# EAGLE design Keybon REV 1.1 (EAGLE 7.7.0)
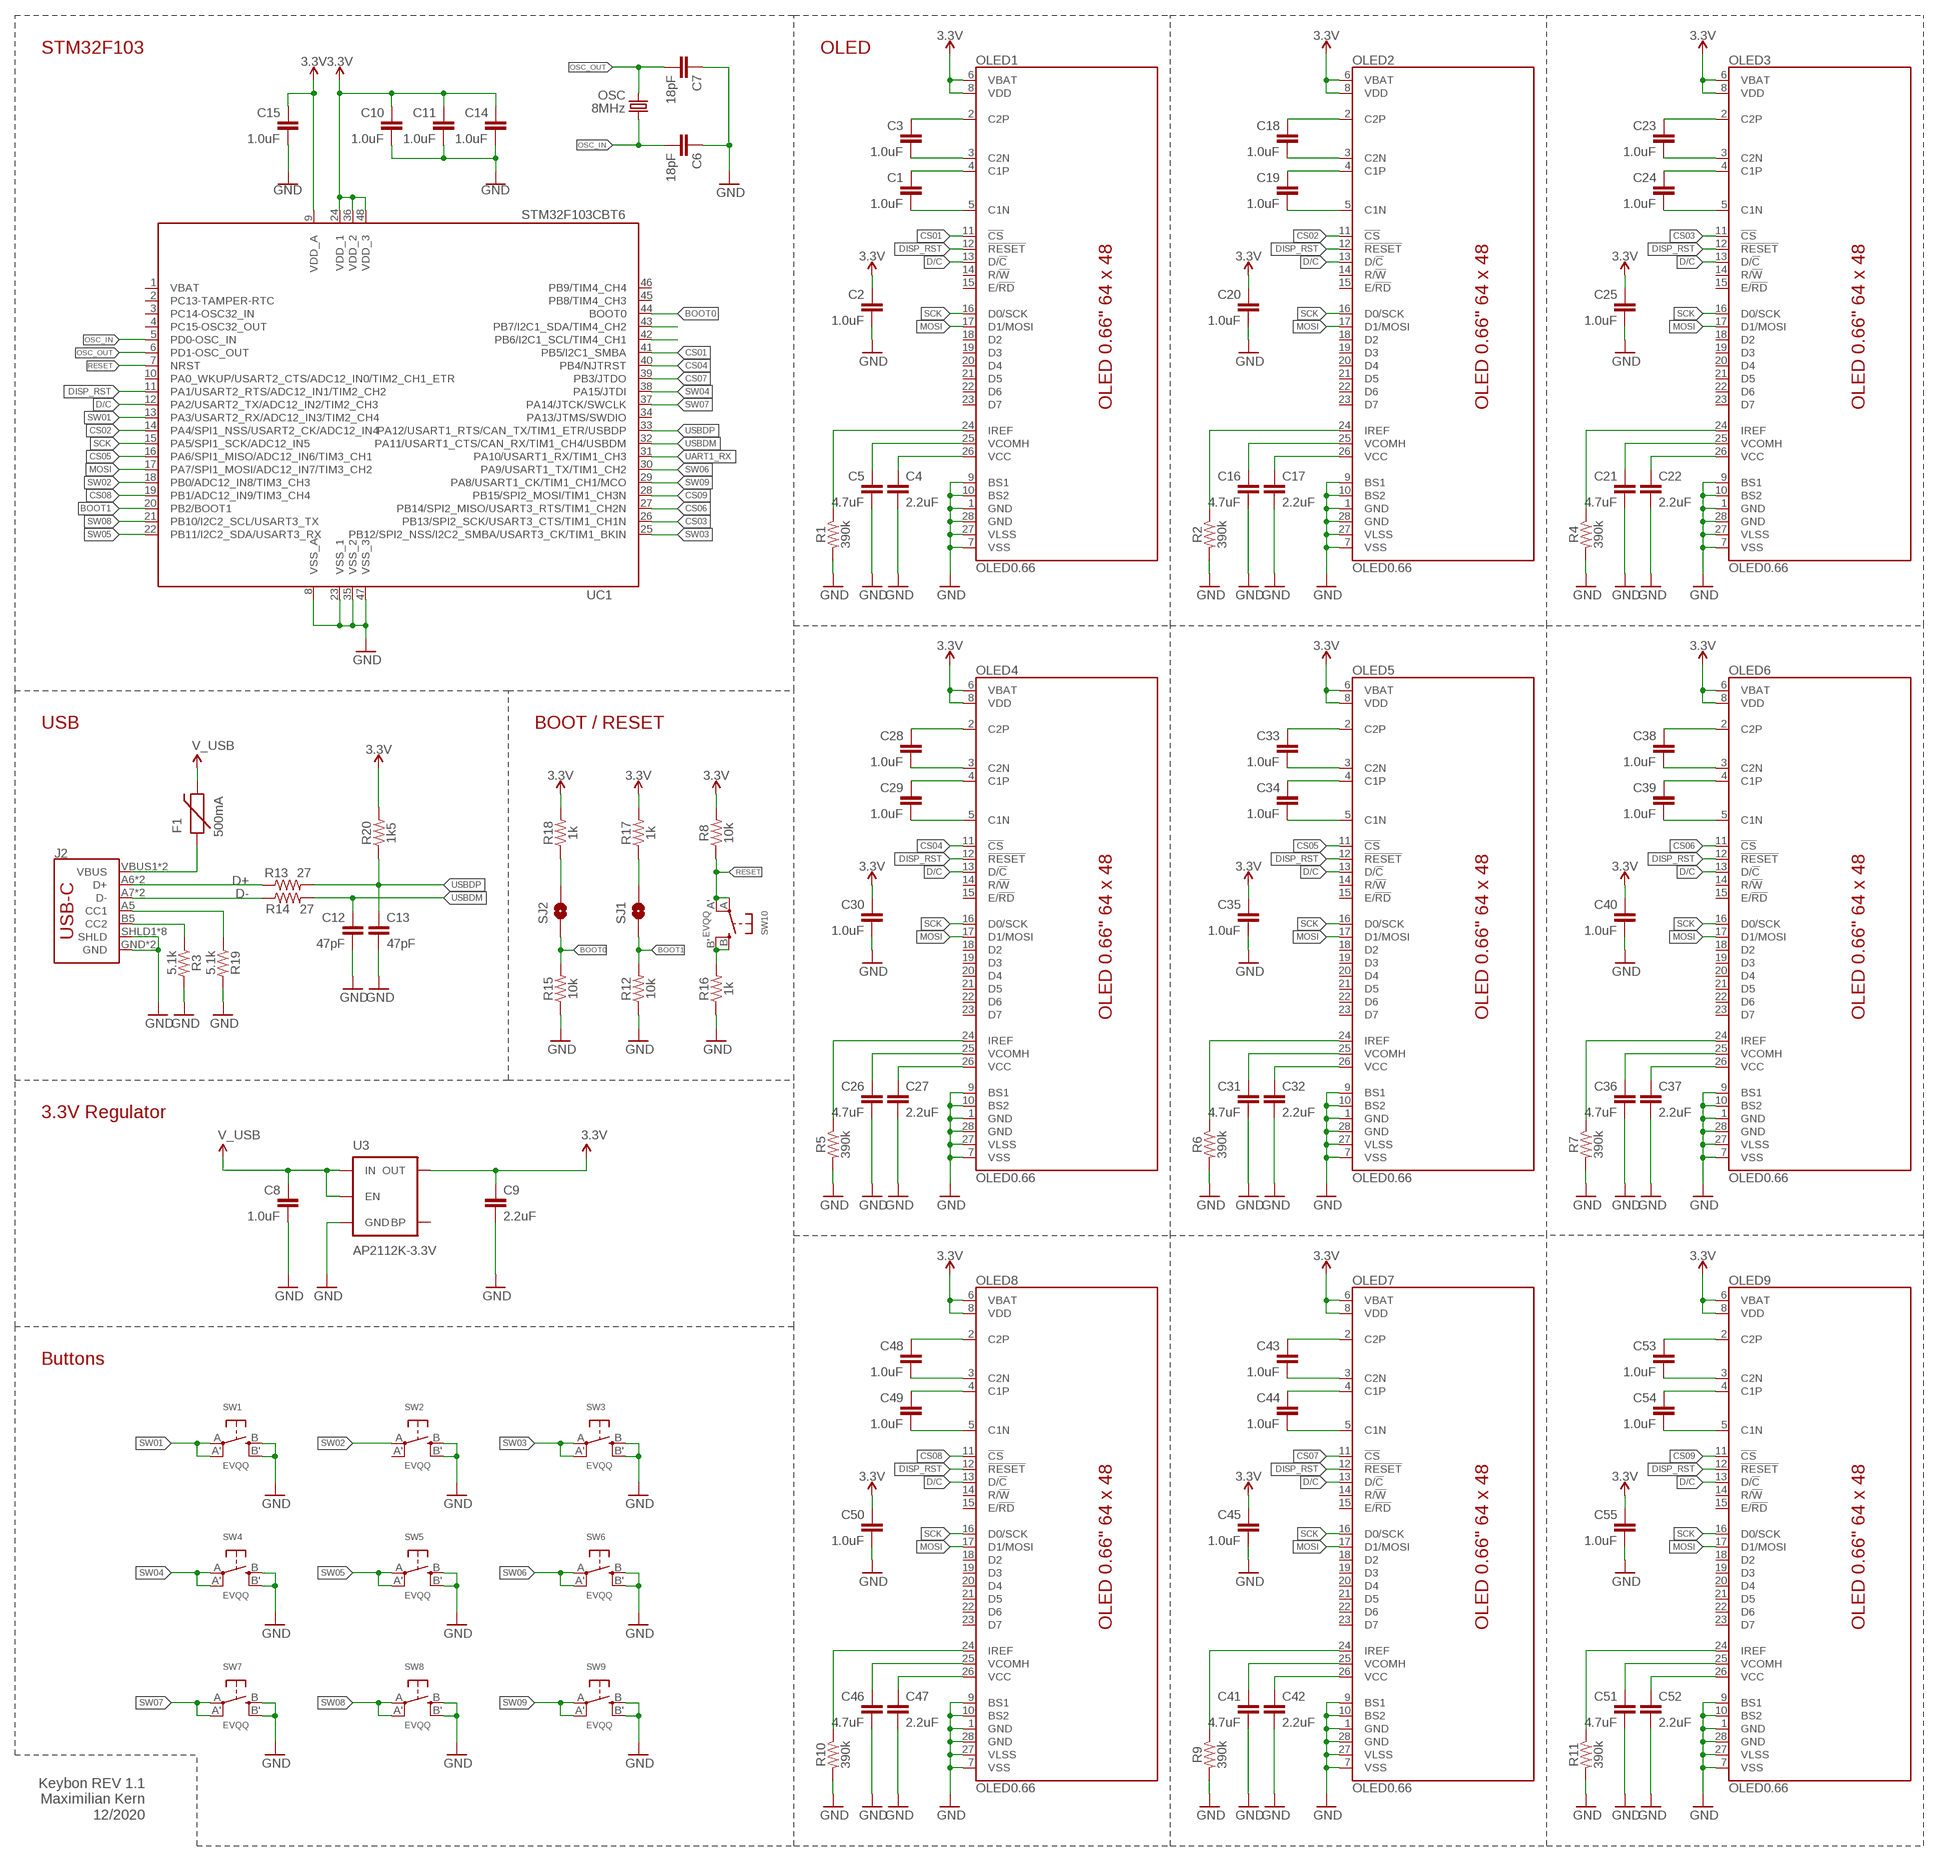
[diagram p0: schematic, sheet 1]

## Parts
C1  1.0uF  1.0UF-0805-25V-(+80/-20%)  [0805]
C2  1.0uF  1.0UF-0805-25V-(+80/-20%)  [0805]
C3  1.0uF  1.0UF-0805-25V-(+80/-20%)  [0805]
C4  2.2uF  1.0UF-0805-25V-(+80/-20%)  [0805]
C5  4.7uF  4.7UF0603  [0603]
C6  18pF  47PF-0603-50V-5%  [0603]
C7  18pF  47PF-0603-50V-5%  [0603]
C8  1.0uF  1.0UF-0805-25V-(+80/-20%)  [0805]
C9  2.2uF  1.0UF-0805-25V-(+80/-20%)  [0805]
C10  1.0uF  1.0UF-0805-25V-(+80/-20%)  [0805]
C11  1.0uF  1.0UF-0805-25V-(+80/-20%)  [0805]
C12  47pF  47PF-0603-50V-5%  [0603]
C13  47pF  47PF-0603-50V-5%  [0603]
C14  1.0uF  1.0UF-0805-25V-(+80/-20%)  [0805]
C15  1.0uF  1.0UF-0805-25V-(+80/-20%)  [0805]
C16  4.7uF  4.7UF0603  [0603]
C17  2.2uF  1.0UF-0805-25V-(+80/-20%)  [0805]
C18  1.0uF  1.0UF-0805-25V-(+80/-20%)  [0805]
C19  1.0uF  1.0UF-0805-25V-(+80/-20%)  [0805]
C20  1.0uF  1.0UF-0805-25V-(+80/-20%)  [0805]
C21  4.7uF  4.7UF0603  [0603]
C22  2.2uF  1.0UF-0805-25V-(+80/-20%)  [0805]
C23  1.0uF  1.0UF-0805-25V-(+80/-20%)  [0805]
C24  1.0uF  1.0UF-0805-25V-(+80/-20%)  [0805]
C25  1.0uF  1.0UF-0805-25V-(+80/-20%)  [0805]
C26  4.7uF  4.7UF0603  [0603]
C27  2.2uF  1.0UF-0805-25V-(+80/-20%)  [0805]
C28  1.0uF  1.0UF-0805-25V-(+80/-20%)  [0805]
C29  1.0uF  1.0UF-0805-25V-(+80/-20%)  [0805]
C30  1.0uF  1.0UF-0805-25V-(+80/-20%)  [0805]
C31  4.7uF  4.7UF0603  [0603]
C32  2.2uF  1.0UF-0805-25V-(+80/-20%)  [0805]
C33  1.0uF  1.0UF-0805-25V-(+80/-20%)  [0805]
C34  1.0uF  1.0UF-0805-25V-(+80/-20%)  [0805]
C35  1.0uF  1.0UF-0805-25V-(+80/-20%)  [0805]
C36  4.7uF  4.7UF0603  [0603]
C37  2.2uF  1.0UF-0805-25V-(+80/-20%)  [0805]
C38  1.0uF  1.0UF-0805-25V-(+80/-20%)  [0805]
C39  1.0uF  1.0UF-0805-25V-(+80/-20%)  [0805]
C40  1.0uF  1.0UF-0805-25V-(+80/-20%)  [0805]
C41  4.7uF  4.7UF0603  [0603]
C42  2.2uF  1.0UF-0805-25V-(+80/-20%)  [0805]
C43  1.0uF  1.0UF-0805-25V-(+80/-20%)  [0805]
C44  1.0uF  1.0UF-0805-25V-(+80/-20%)  [0805]
C45  1.0uF  1.0UF-0805-25V-(+80/-20%)  [0805]
C46  4.7uF  4.7UF0603  [0603]
C47  2.2uF  1.0UF-0805-25V-(+80/-20%)  [0805]
C48  1.0uF  1.0UF-0805-25V-(+80/-20%)  [0805]
C49  1.0uF  1.0UF-0805-25V-(+80/-20%)  [0805]
C50  1.0uF  1.0UF-0805-25V-(+80/-20%)  [0805]
C51  4.7uF  4.7UF0603  [0603]
C52  2.2uF  1.0UF-0805-25V-(+80/-20%)  [0805]
C53  1.0uF  1.0UF-0805-25V-(+80/-20%)  [0805]
C54  1.0uF  1.0UF-0805-25V-(+80/-20%)  [0805]
C55  1.0uF  1.0UF-0805-25V-(+80/-20%)  [0805]
F1  500mA  PTCSMD  [PTC-1206]
J2  USB_C16PIN  [USB-C-16P]
OLED1  OLED0.66  [OLED-0.66-64X48]
OLED2  OLED0.66  [OLED-0.66-64X48]
OLED3  OLED0.66  [OLED-0.66-64X48]
OLED4  OLED0.66  [OLED-0.66-64X48]
OLED5  OLED0.66  [OLED-0.66-64X48]
OLED6  OLED0.66  [OLED-0.66-64X48]
OLED7  OLED0.66  [OLED-0.66-64X48]
OLED8  OLED0.66  [OLED-0.66-64X48]
OLED9  OLED0.66  [OLED-0.66-64X48]
OSC  8MHz  CRYSTAL5X3  [CRYSTAL-SMD-5X3]
R1  390k  10KOHM-0603-1/10W-1%  [0603]
R2  390k  10KOHM-0603-1/10W-1%  [0603]
R3  5.1k  10KOHM-0603-1/10W-1%  [0603]
R4  390k  10KOHM-0603-1/10W-1%  [0603]
R5  390k  10KOHM-0603-1/10W-1%  [0603]
R6  390k  10KOHM-0603-1/10W-1%  [0603]
R7  390k  10KOHM-0603-1/10W-1%  [0603]
R8  10k  10KOHM-0603-1/10W-1%  [0603]
R9  390k  10KOHM-0603-1/10W-1%  [0603]
R10  390k  10KOHM-0603-1/10W-1%  [0603]
R11  390k  10KOHM-0603-1/10W-1%  [0603]
R12  10k  10KOHM-0603-1/10W-1%  [0603]
R13  27  27OHM1/10W1%(0603)0603-RES  [0603]
R14  27  27OHM1/10W1%(0603)0603-RES  [0603]
R15  10k  10KOHM-0603-1/10W-1%  [0603]
R16  1k  10KOHM-0603-1/10W-1%  [0603]
R17  1k  10KOHM-0603-1/10W-1%  [0603]
R18  1k  10KOHM-0603-1/10W-1%  [0603]
R19  5.1k  10KOHM-0603-1/10W-1%  [0603]
R20  1k5  10KOHM-0603-1/10W-1%  [0603]
SJ1  JUMPER-PAD-2-NOYES_SILK  [PAD-JUMPER-2-NO_YES_SILK]
SJ2  JUMPER-PAD-2-NOYES_SILK  [PAD-JUMPER-2-NO_YES_SILK]
SW1  EVQQ  SWITCH_TACT_SMT_EVQQ2_SMALL  [EVQ-Q2_SMALLER]
SW2  EVQQ  SWITCH_TACT_SMT_EVQQ2_SMALL  [EVQ-Q2_SMALLER]
SW3  EVQQ  SWITCH_TACT_SMT_EVQQ2_SMALL  [EVQ-Q2_SMALLER]
SW4  EVQQ  SWITCH_TACT_SMT_EVQQ2_SMALL  [EVQ-Q2_SMALLER]
SW5  EVQQ  SWITCH_TACT_SMT_EVQQ2_SMALL  [EVQ-Q2_SMALLER]
SW6  EVQQ  SWITCH_TACT_SMT_EVQQ2_SMALL  [EVQ-Q2_SMALLER]
SW7  EVQQ  SWITCH_TACT_SMT_EVQQ2_SMALL  [EVQ-Q2_SMALLER]
SW8  EVQQ  SWITCH_TACT_SMT_EVQQ2_SMALL  [EVQ-Q2_SMALLER]
SW9  EVQQ  SWITCH_TACT_SMT_EVQQ2_SMALL  [EVQ-Q2_SMALLER]
SW10  EVQQ  SWITCH_TACT_SMT_EVQQ2_SMALL  [EVQ-Q2_SMALLER]
U3  AP2112K-3.3V  V_REG_LDOSMD  [SOT23-5]
UC1  STM32F103CBT6  STM32F103CB  [LQFP48]

## Nets
3.3V: C2.1 C9.1 C10.1 C11.1 C14.1 C15.1 C20.1 C25.1 C30.1 C35.1 C40.1 C45.1 C50.1 C55.1 OLED1.6(VBAT) OLED1.8(VDD) OLED2.6(VBAT) OLED2.8(VDD) OLED3.6(VBAT) OLED3.8(VDD) OLED4.6(VBAT) OLED4.8(VDD) OLED5.6(VBAT) OLED5.8(VDD) OLED6.6(VBAT) OLED6.8(VDD) OLED7.6(VBAT) OLED7.8(VDD) OLED8.6(VBAT) OLED8.8(VDD) OLED9.6(VBAT) OLED9.8(VDD) R8.2 R17.2 R18.2 R20.2 U3.5(OUT) UC1.9(VDD_A) UC1.24(VDD_1) UC1.36(VDD_2) UC1.48(VDD_3)
BOOT0: R15.2 SJ2.1 UC1.44(BOOT0)
BOOT1: R12.2 SJ1.1 UC1.20(PB2/BOOT1)
C1N: C1.2 OLED1.5(C1N)
C1N1: C19.2 OLED2.5(C1N)
C1N2: C24.2 OLED3.5(C1N)
C1N3: C29.2 OLED4.5(C1N)
C1N4: C34.2 OLED5.5(C1N)
C1N5: C39.2 OLED6.5(C1N)
C1N6: C44.2 OLED7.5(C1N)
C1N7: C49.2 OLED8.5(C1N)
C1N8: C54.2 OLED9.5(C1N)
C1P: C1.1 OLED1.4(C1P)
C1P1: C19.1 OLED2.4(C1P)
C1P2: C24.1 OLED3.4(C1P)
C1P3: C29.1 OLED4.4(C1P)
C1P4: C34.1 OLED5.4(C1P)
C1P5: C39.1 OLED6.4(C1P)
C1P6: C44.1 OLED7.4(C1P)
C1P7: C49.1 OLED8.4(C1P)
C1P8: C54.1 OLED9.4(C1P)
C2N: C3.2 OLED1.3(C2N)
C2N1: C18.2 OLED2.3(C2N)
C2N2: C23.2 OLED3.3(C2N)
C2N3: C28.2 OLED4.3(C2N)
C2N4: C33.2 OLED5.3(C2N)
C2N5: C38.2 OLED6.3(C2N)
C2N6: C43.2 OLED7.3(C2N)
C2N7: C48.2 OLED8.3(C2N)
C2N8: C53.2 OLED9.3(C2N)
C2P: C3.1 OLED1.2(C2P)
C2P1: C18.1 OLED2.2(C2P)
C2P2: C23.1 OLED3.2(C2P)
C2P3: C28.1 OLED4.2(C2P)
C2P4: C33.1 OLED5.2(C2P)
C2P5: C38.1 OLED6.2(C2P)
C2P6: C43.1 OLED7.2(C2P)
C2P7: C48.1 OLED8.2(C2P)
C2P8: C53.1 OLED9.2(C2P)
CS01: OLED1.11(!CS!) UC1.41(PB5/I2C1_SMBA)
CS02: OLED2.11(!CS!) UC1.14(PA4/SPI1_NSS/USART2_CK/ADC12_IN4)
CS03: OLED3.11(!CS!) UC1.26(PB13/SPI2_SCK/USART3_CTS/TIM1_CH1N)
CS04: OLED4.11(!CS!) UC1.40(PB4/NJTRST)
CS05: OLED5.11(!CS!) UC1.16(PA6/SPI1_MISO/ADC12_IN6/TIM3_CH1)
CS06: OLED6.11(!CS!) UC1.27(PB14/SPI2_MISO/USART3_RTS/TIM1_CH2N)
CS07: OLED7.11(!CS!) UC1.39(PB3/JTDO)
CS08: OLED8.11(!CS!) UC1.19(PB1/ADC12_IN9/TIM3_CH4)
CS09: OLED9.11(!CS!) UC1.28(PB15/SPI2_MOSI/TIM1_CH3N)
D+: J2.A6(D+) J2.B6(D+) R13.1
D-: J2.A7(D-) J2.B7(D-) R14.1
D/C: OLED1.13(D/!C!) OLED2.13(D/!C!) OLED3.13(D/!C!) OLED4.13(D/!C!) OLED5.13(D/!C!) OLED6.13(D/!C!) OLED7.13(D/!C!) OLED8.13(D/!C!) OLED9.13(D/!C!) UC1.12(PA2/USART2_TX/ADC12_IN2/TIM2_CH3)
DISP_RST: OLED1.12(!RESET!) OLED2.12(!RESET!) OLED3.12(!RESET!) OLED4.12(!RESET!) OLED5.12(!RESET!) OLED6.12(!RESET!) OLED7.12(!RESET!) OLED8.12(!RESET!) OLED9.12(!RESET!) UC1.11(PA1/USART2_RTS/ADC12_IN1/TIM2_CH2)
GND: C2.2 C4.2 C5.2 C6.1 C7.1 C8.2 C9.2 C10.2 C11.2 C12.2 C13.2 C14.2 C15.2 C16.2 C17.2 C20.2 C21.2 C22.2 C25.2 C26.2 C27.2 C30.2 C31.2 C32.2 C35.2 C36.2 C37.2 C40.2 C41.2 C42.2 C45.2 C46.2 C47.2 C50.2 C51.2 C52.2 C55.2 J2.GND J2.GND2(GND) J2.SHLD1(SHLD) J2.SHLD2(SHLD) J2.SHLD3(SHLD) J2.SHLD4(SHLD) J2.SHLD5(SHLD) J2.SHLD6(SHLD) J2.SHLD7(SHLD) J2.SHLD8(SHLD) OLED1.1(GND) OLED1.7(VSS) OLED1.9(BS1) OLED1.10(BS2) OLED1.27(VLSS) OLED1.28(GND) OLED2.1(GND) OLED2.7(VSS) OLED2.9(BS1) OLED2.10(BS2) OLED2.27(VLSS) OLED2.28(GND) OLED3.1(GND) OLED3.7(VSS) OLED3.9(BS1) OLED3.10(BS2) OLED3.27(VLSS) OLED3.28(GND) OLED4.1(GND) OLED4.7(VSS) OLED4.9(BS1) OLED4.10(BS2) OLED4.27(VLSS) OLED4.28(GND) OLED5.1(GND) OLED5.7(VSS) OLED5.9(BS1) OLED5.10(BS2) OLED5.27(VLSS) OLED5.28(GND) OLED6.1(GND) OLED6.7(VSS) OLED6.9(BS1) OLED6.10(BS2) OLED6.27(VLSS) OLED6.28(GND) OLED7.1(GND) OLED7.7(VSS) OLED7.9(BS1) OLED7.10(BS2) OLED7.27(VLSS) OLED7.28(GND) OLED8.1(GND) OLED8.7(VSS) OLED8.9(BS1) OLED8.10(BS2) OLED8.27(VLSS) OLED8.28(GND) OLED9.1(GND) OLED9.7(VSS) OLED9.9(BS1) OLED9.10(BS2) OLED9.27(VLSS) OLED9.28(GND) R1.2 R2.2 R3.2 R4.2 R5.2 R6.2 R7.2 R9.2 R10.2 R11.2 R12.1 R15.1 R16.1 R19.2 SW1.B'(S1) SW1.B(S) SW2.B'(S1) SW2.B(S) SW3.B'(S1) SW3.B(S) SW4.B'(S1) SW4.B(S) SW5.B'(S1) SW5.B(S) SW6.B'(S1) SW6.B(S) SW7.B'(S1) SW7.B(S) SW8.B'(S1) SW8.B(S) SW9.B'(S1) SW9.B(S) U3.2(GND) UC1.8(VSS_A) UC1.23(VSS_1) UC1.35(VSS_2) UC1.47(VSS_3)
IREF: OLED1.24(IREF) R1.1
IREF1: OLED2.24(IREF) R2.1
IREF2: OLED3.24(IREF) R4.1
IREF3: OLED4.24(IREF) R5.1
IREF4: OLED5.24(IREF) R6.1
IREF5: OLED6.24(IREF) R7.1
IREF6: OLED7.24(IREF) R9.1
IREF7: OLED8.24(IREF) R10.1
IREF8: OLED9.24(IREF) R11.1
MOSI: OLED1.17(D1/MOSI) OLED2.17(D1/MOSI) OLED3.17(D1/MOSI) OLED4.17(D1/MOSI) OLED5.17(D1/MOSI) OLED6.17(D1/MOSI) OLED7.17(D1/MOSI) OLED8.17(D1/MOSI) OLED9.17(D1/MOSI) UC1.17(PA7/SPI1_MOSI/ADC12_IN7/TIM3_CH2)
N$1: R16.2 SW10.B'(S1) SW10.B(S)
N$2: R18.1 SJ2.2
N$3: R17.1 SJ1.2
N$4: C4.1 OLED1.26(VCC)
N$5: C17.1 OLED2.26(VCC)
N$6: C22.1 OLED3.26(VCC)
N$7: C37.1 OLED6.26(VCC)
N$8: C32.1 OLED5.26(VCC)
N$9: J2.A5(CC1) R19.1
N$10: C27.1 OLED4.26(VCC)
N$11: J2.B5(CC2) R3.1
N$12: C47.1 OLED8.26(VCC)
N$13: C42.1 OLED7.26(VCC)
N$14: C52.1 OLED9.26(VCC)
N$19: UC1.42(PB6/I2C1_SCL/TIM4_CH1)
N$20: UC1.43(PB7/I2C1_SDA/TIM4_CH2)
OSC_IN: C6.2 OSC.1 UC1.5(PD0-OSC_IN)
OSC_OUT: C7.2 OSC.3 UC1.6(PD1-OSC_OUT)
RESET: R8.1 SW10.A'(P1) SW10.A(P) UC1.7(NRST)
SCK: OLED1.16(D0/SCK) OLED2.16(D0/SCK) OLED3.16(D0/SCK) OLED4.16(D0/SCK) OLED5.16(D0/SCK) OLED6.16(D0/SCK) OLED7.16(D0/SCK) OLED8.16(D0/SCK) OLED9.16(D0/SCK) UC1.15(PA5/SPI1_SCK/ADC12_IN5)
SW01: SW1.A'(P1) SW1.A(P) UC1.13(PA3/USART2_RX/ADC12_IN3/TIM2_CH4)
SW02: SW2.A(P) UC1.18(PB0/ADC12_IN8/TIM3_CH3)
SW03: SW3.A'(P1) SW3.A(P) UC1.25(PB12/SPI2_NSS/I2C2_SMBA/USART3_CK/TIM1_BKIN)
SW04: SW4.A'(P1) SW4.A(P) UC1.38(PA15/JTDI)
SW05: SW5.A'(P1) SW5.A(P) UC1.22(PB11/I2C2_SDA/USART3_RX)
SW06: SW6.A'(P1) SW6.A(P) UC1.30(PA9/USART1_TX/TIM1_CH2)
SW07: SW7.A'(P1) SW7.A(P) UC1.37(PA14/JTCK/SWCLK)
SW08: SW8.A'(P1) SW8.A(P) UC1.21(PB10/I2C2_SCL/USART3_TX)
SW09: SW9.A'(P1) SW9.A(P) UC1.29(PA8/USART1_CK/TIM1_CH1/MCO)
UART1_RX: UC1.31(PA10/USART1_RX/TIM1_CH3)
USBDM: C12.1 R14.2 UC1.32(PA11/USART1_CTS/CAN_RX/TIM1_CH4/USBDM)
USBDP: C13.1 R13.2 R20.1 UC1.33(PA12/USART1_RTS/CAN_TX/TIM1_ETR/USBDP)
V_USB: C8.1 F1.2 U3.1(IN) U3.3(EN)
VCOMH: C5.1 OLED1.25(VCOMH)
VCOMH1: C16.1 OLED2.25(VCOMH)
VCOMH2: C21.1 OLED3.25(VCOMH)
VCOMH3: C26.1 OLED4.25(VCOMH)
VCOMH4: C31.1 OLED5.25(VCOMH)
VCOMH5: C36.1 OLED6.25(VCOMH)
VCOMH6: C41.1 OLED7.25(VCOMH)
VCOMH7: C46.1 OLED8.25(VCOMH)
VCOMH8: C51.1 OLED9.25(VCOMH)
VUSB-RAW: F1.1 J2.VBUS1(VBUS) J2.VBUS2(VBUS)
Unconnected: OLED1.14(R/!W!) OLED1.15(E/!RD!) OLED1.18(D2) OLED1.19(D3) OLED1.20(D4) OLED1.21(D5) OLED1.22(D6) OLED1.23(D7) OLED2.14(R/!W!) OLED2.15(E/!RD!) OLED2.18(D2) OLED2.19(D3) OLED2.20(D4) OLED2.21(D5) OLED2.22(D6) OLED2.23(D7) OLED3.14(R/!W!) OLED3.15(E/!RD!) OLED3.18(D2) OLED3.19(D3) OLED3.20(D4) OLED3.21(D5) OLED3.22(D6) OLED3.23(D7) OLED4.14(R/!W!) OLED4.15(E/!RD!) OLED4.18(D2) OLED4.19(D3) OLED4.20(D4) OLED4.21(D5) OLED4.22(D6) OLED4.23(D7) OLED5.14(R/!W!) OLED5.15(E/!RD!) OLED5.18(D2) OLED5.19(D3) OLED5.20(D4) OLED5.21(D5) OLED5.22(D6) OLED5.23(D7) OLED6.14(R/!W!) OLED6.15(E/!RD!) OLED6.18(D2) OLED6.19(D3) OLED6.20(D4) OLED6.21(D5) OLED6.22(D6) OLED6.23(D7) OLED7.14(R/!W!) OLED7.15(E/!RD!) OLED7.18(D2) OLED7.19(D3) OLED7.20(D4) OLED7.21(D5) OLED7.22(D6) OLED7.23(D7) OLED8.14(R/!W!) OLED8.15(E/!RD!) OLED8.18(D2) OLED8.19(D3) OLED8.20(D4) OLED8.21(D5) OLED8.22(D6) OLED8.23(D7) OLED9.14(R/!W!) OLED9.15(E/!RD!) OLED9.18(D2) OLED9.19(D3) OLED9.20(D4) OLED9.21(D5) OLED9.22(D6) OLED9.23(D7) SW2.A'(P1) U3.4(BP) UC1.2(PC13-TAMPER-RTC) UC1.3(PC14-OSC32_IN) UC1.4(PC15-OSC32_OUT) UC1.10(PA0_WKUP/USART2_CTS/ADC12_IN0/TIM2_CH1_ETR) UC1.34(PA13/JTMS/SWDIO) UC1.45(PB8/TIM4_CH3) UC1.46(PB9/TIM4_CH4)

## Notes on the sheet
- STM32F103 | OLED
- USB | BOOT / RESET
- 3.3V Regulator
- Buttons
- Keybon REV 1.1
  Maximilian Kern
  12/2020

## Power pins joined to a net without a drawn wire
VBAT: UC1.1(VBAT)

## Library data of the parts
C1-C3 C8 C10 C11 C14 C15 C18-C20 C23-C25 C28-C30 C33-C35 C38-C40 C43-C45 C48-C50 C53-C55 = SparkFun-Capacitors:1.0UF: 1µF ceramic capacitors A capacitor is a passive two-terminal electrical component used to store electrical energy temporarily in an electric field.; PROD_ID: CAP-11625
C4 C9 C17 C22 C27 C32 C37 C42 C47 C52 = SparkFun-Capacitors:1.0UF: 1µF ceramic capacitors A capacitor is a passive two-terminal electrical component used to store electrical energy temporarily in an electric field.; PROD_ID: CAP-11625; VALUE: 1.0uF
C5 C16 C21 C26 C31 C36 C41 C46 C51 = SparkFun-Capacitors:4.7UF: 4.7µF ceramic capacitors A capacitor is a passive two-terminal electrical component used to store electrical energy temporarily in an electric field.; PROD_ID: CAP-08280
C6 C7 = SparkFun-Capacitors:47PF: 47pF ceramic capacitors A capacitor is a passive two-terminal electrical component used to store electrical energy temporarily in an electric field.; PROD_ID: CAP-08913; VALUE: 47pF
C12 C13 = SparkFun-Capacitors:47PF: 47pF ceramic capacitors A capacitor is a passive two-terminal electrical component used to store electrical energy temporarily in an electric field.; PROD_ID: CAP-08913
F1 = SparkFun-PowerIC:PTC: Resettable Fuse PTC Resettable Fuse. Spark Fun Electronics SKU : COM-08357; PROD_ID: RES-11150
J2 = SparkFun-Connectors:USB_C: USB Type C 16Pin Connector Super Speed pins not available on the 16-pin purely SMD connector so this part is best for USB 2.0 implementations. D1 and D2 are tied together enabling D+/- no matter which way the cable is plugged into the connector. The two channel configuration pins (CC1/2) are exposed. These are normally connected to ground via 5.1k resistors but can be reconfigured for high current/high power applications.; PROD_ID: CONN-14122
OLED1-OLED9 = microView-temp:OLED0.66
OSC = SparkFun2:CRYSTAL: Crystals Various standard crystals. Proven footprints. Spark Fun Electronics SKU : COM-00534
R1-R7 R9-R11 R16-R20 = SparkFun-Resistors:10KOHM: 10kΩ resistor A resistor is a passive two-terminal electrical component that implements electrical resistance as a circuit element. Resistors act to reduce current flow, and, at the same time, act to lower voltage levels within circuits. - Wikipedia; PROD_ID: RES-00824; VALUE: 10k
R8 R12 R15 = SparkFun-Resistors:10KOHM: 10kΩ resistor A resistor is a passive two-terminal electrical component that implements electrical resistance as a circuit element. Resistors act to reduce current flow, and, at the same time, act to lower voltage levels within circuits. - Wikipedia; PROD_ID: RES-00824
R13 R14 = SparkFun-Resistors:27OHM1/10W1%(0603): RES-09334; PROD_ID: RES-09334
SJ1 SJ2 = SparkFun-Passives:JUMPER-PAD-2-NO
SW1-SW10 = microbuilder:SWITCH_TACT_SMT: SMT Tact Switches 6x6mm - Digikey: P12940SCT-ND KMR2 (4.6x2.8mm) - Digikey: 401-1426-1-ND EVQ-PQHB55 - Light Touch, 160GF (4.5x4.5mm) - Digikey: P8090SCT-ND KMT0 - KMT021 NGJ LHS (etc.) IP68/Waterproof - Digikey: CKN10289CT-ND
U3 = SparkFun-PowerIC:V_REG_LDO: Voltage Regulator LDO Standard 150mA LDO voltage regulator in SOT-23 layout. Micrel part MIC5205. BP (by-pass) pin is used to lower output noise with 470pF cap.; PROD_ID: VREG-12457
UC1 = stm32:STM32F103CB

## Board
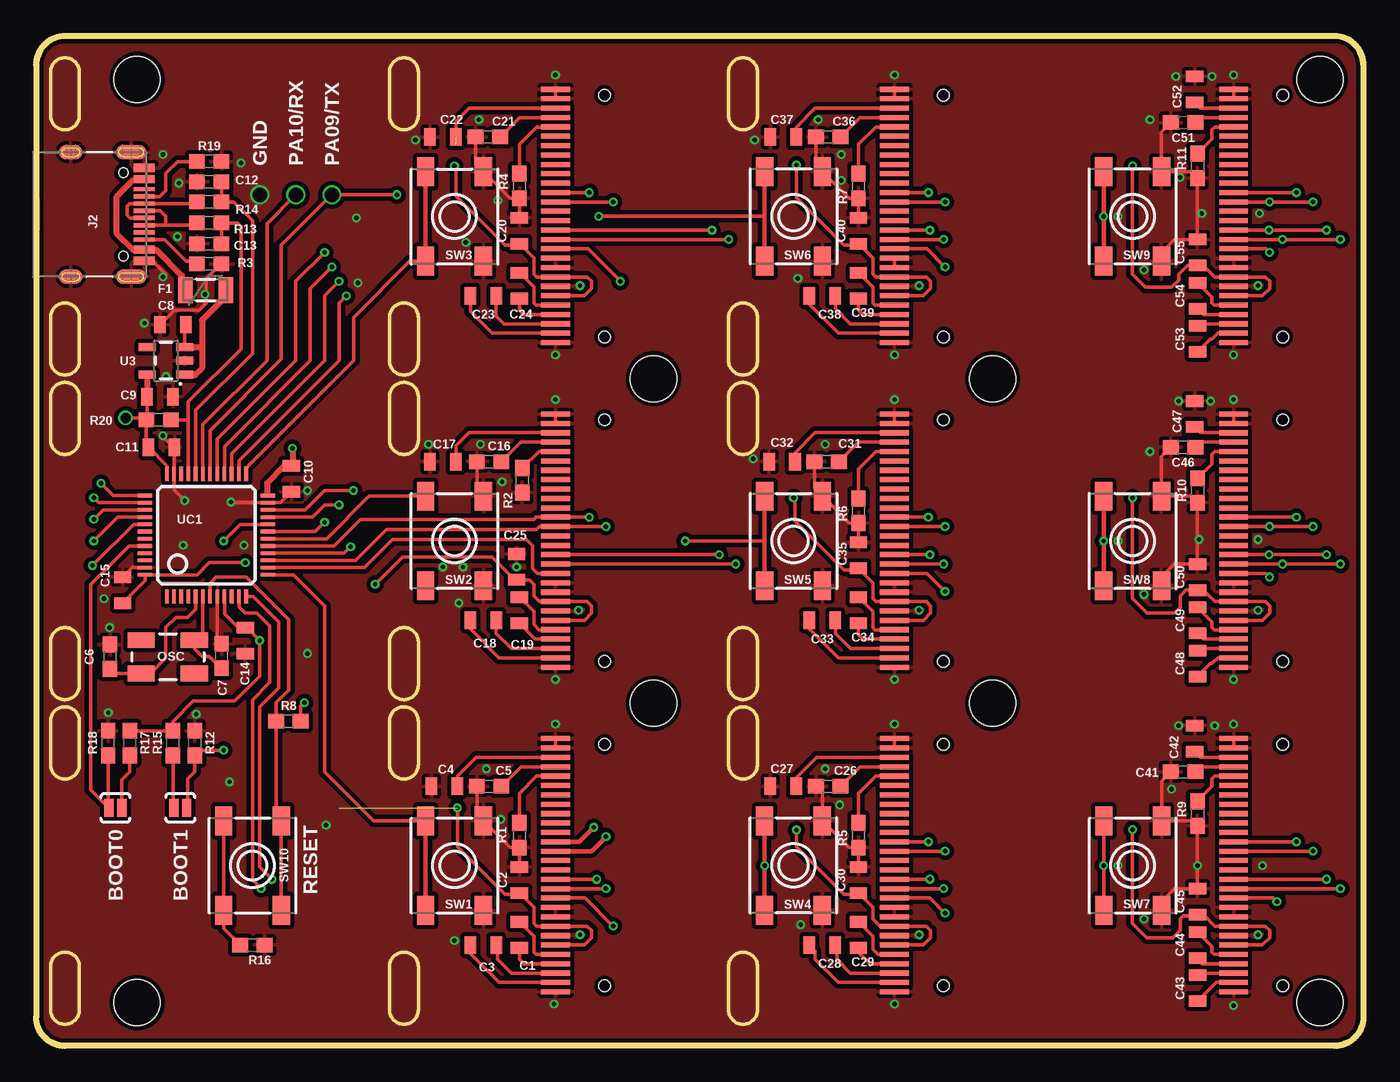
[diagram p1: board, top side]
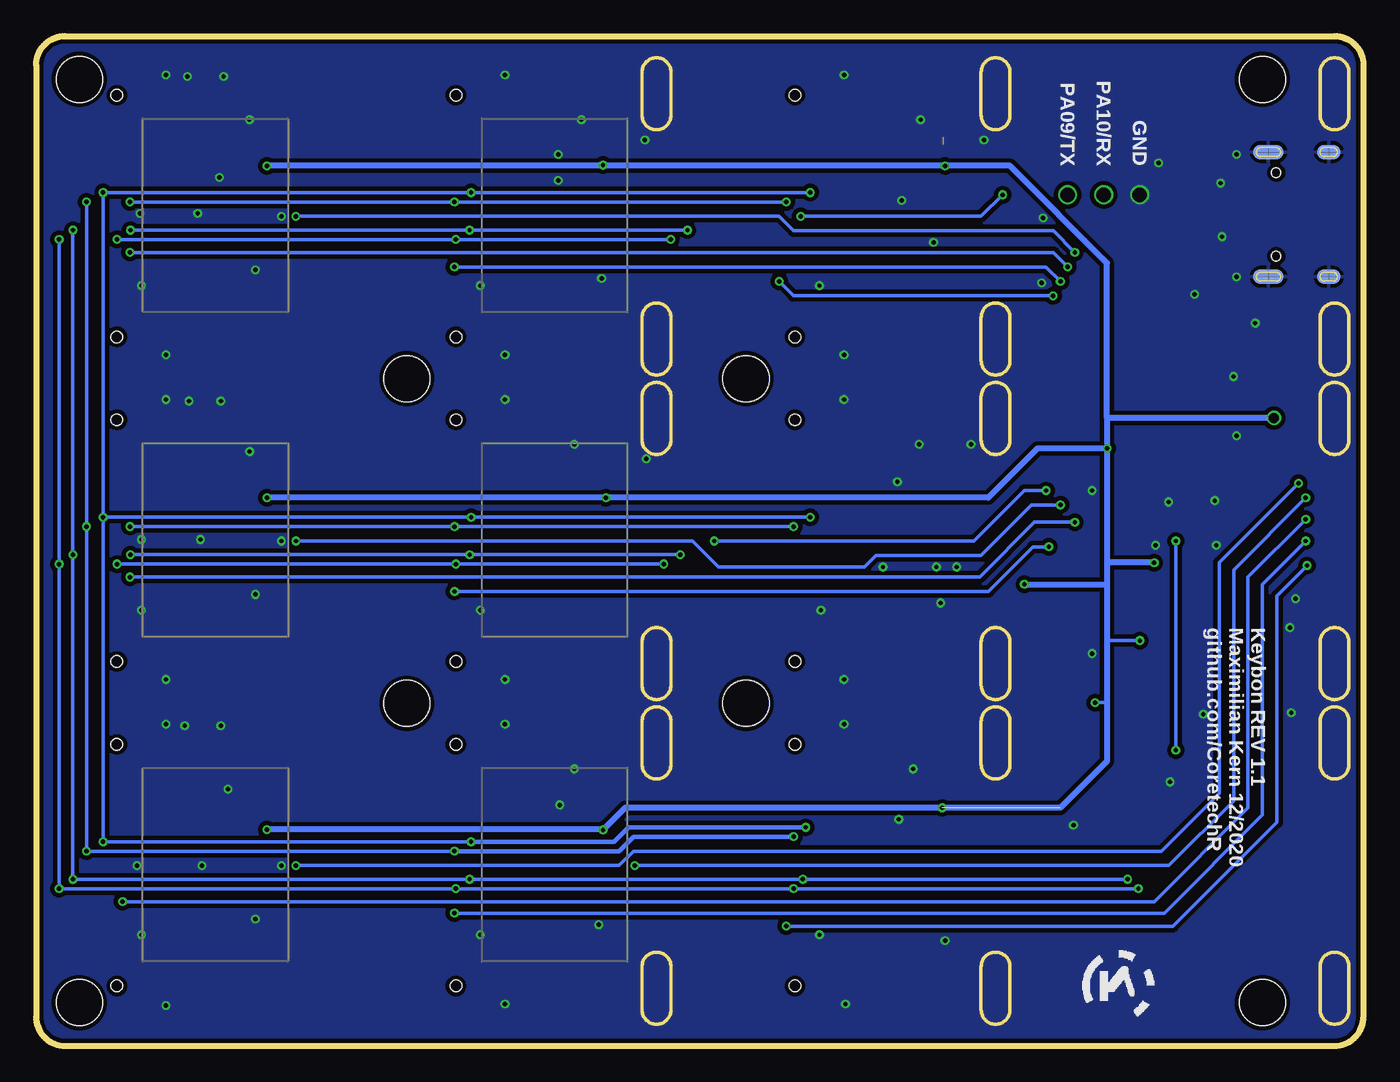
[diagram p2: board, bottom side, seen from below]

Size 92 x 70 mm. Coordinates in mm from the lower left corner, seen from the top.
Outline: 90,0 2,0 arc-90 0,2 0,68 arc-90 2,70 90,70 arc-90 92,68 92,2 arc-90 90,0
Copper layers (1*16): Top 0.035mm / dielectric 1.5mm / Bottom 0.035mm
Design rules "aisler_2_layer *": minimum track width 0.1mm, minimum drill 0.2mm, track to track 0.15mm, track to pad 0.1mm, pad to pad 0.1mm, via to via 0.1mm, smd to smd 0.1mm, copper to edge 0.2mm, drill to drill 0.21mm, minimum pad ring 0.25mm, minimum via ring 0.15mm, stop-mask expansion 2.5mil, vias tented up to drill 43mil, thermal gap 10mil
Holes 3.2 mm at 7,3 89,3 89,67 7,67 66.3,23.75 42.8,23.75 42.8,46.25 66.3,46.25
Milling: 72 lines

### Footprints (pad centres in the part's own frame; a part is rotated, then mirrored left to right if it is on the bottom)
0805 = smd 0.8 x 1.2: 1 -0.9,0; 2 0.9,0
0603 = smd 1.1 x 1: 1 -0.85,0; 2 0.85,0
PTC-1206 = smd 1 x 1.8: 1 -1.4,0; 2 1.4,0
USB-C-16P = smd 0.3 x 1.45: A5 -1.25,0; A6 -0.25,0; A7 0.25,0; A8 1.25,0; B5 1.75,0; B6 0.75,0; B7 -0.75,0; B8 -1.75,0 | smd 0.6 x 1.45: GND -3.225,0; GND2 3.225,0 | smd 1 x 2.1: SHLD1 -4.32,-0.915; SHLD2 4.32,-0.915 | smd 1 x 2.1 bottom: SHLD3 -4.32,-0.915; SHLD4 4.32,-0.915 | smd 1 x 1.6: SHLD5 -4.32,-5.095; SHLD8 4.32,-5.095 | smd 1 x 1.6 bottom: SHLD6 -4.32,-5.095; SHLD7 4.32,-5.095 | smd 0.55 x 1.45: VBUS1 -2.45,0; VBUS2 2.45,0 | hole 0.65: -2.89,-1.445; 2.89,-1.445
OLED-0.66-64X48 = smd 0.35 x 2: 1 0,0; 2 0.65,0; 3 1.3,0; 4 1.95,0; 5 2.6,0; 6 3.25,0; 7 3.9,0; 8 4.55,0; 9 5.2,0; 10 5.85,0; 11 6.5,0; 12 7.15,0; 13 7.8,0; 14 8.45,0; 15 9.1,0; 16 9.75,0; 17 10.4,0; 18 11.05,0; 19 11.7,0; 20 12.35,0; 21 13,0; 22 13.65,0; 23 14.3,0; 24 14.95,0; 25 15.6,0; 26 16.25,0; 27 16.9,0; 28 17.55,0 | hole 0.8: 17.15,-3.4; 0.4,-3.4
CRYSTAL-SMD-5X3 = smd 1.9 x 1.1: 1 -1.85,-1.15; 2 1.85,-1.15; 3 1.85,1.15; 4 -1.85,1.15
PAD-JUMPER-2-NO_YES_SILK = smd 0.635 x 1.27: 1 -0.45,0; 2 0.45,0
EVQ-Q2_SMALLER = smd 2 x 1.2: A -3.1,-2; A' 3.1,-2; B -3.1,2; B' 3.1,2
SOT23-5 = smd 0.55 x 1.2: 1 -0.95,-1.3; 2 0,-1.3; 3 0.95,-1.3; 4 0.95,1.3; 5 -0.95,1.3
LQFP48 = smd 0.254 x 1: 1 -2.75,-4.25; 2 -2.25,-4.25; 3 -1.75,-4.25; 4 -1.25,-4.25; 5 -0.75,-4.25; 6 -0.25,-4.25; 7 0.25,-4.25; 8 0.75,-4.25; 9 1.25,-4.25; 10 1.75,-4.25; 11 2.25,-4.25; 12 2.75,-4.25; 25 2.75,4.25; 26 2.25,4.25; 27 1.75,4.25; 28 1.25,4.25; 29 0.75,4.25; 30 0.25,4.25; 31 -0.25,4.25; 32 -0.75,4.25; 33 -1.25,4.25; 34 -1.75,4.25; 35 -2.25,4.25; 36 -2.75,4.25 | smd 1 x 0.254: 13 4.25,-2.75; 14 4.25,-2.25; 15 4.25,-1.75; 16 4.25,-1.25; 17 4.25,-0.75; 18 4.25,-0.25; 19 4.25,0.25; 20 4.25,0.75; 21 4.25,1.25; 22 4.25,1.75; 23 4.25,2.25; 24 4.25,2.75; 37 -4.25,2.75; 38 -4.25,2.25; 39 -4.25,1.75; 40 -4.25,1.25; 41 -4.25,0.75; 42 -4.25,0.25; 43 -4.25,-0.25; 44 -4.25,-0.75; 45 -4.25,-1.25; 46 -4.25,-1.75; 47 -4.25,-2.25; 48 -4.25,-2.75

### Placement (x,y rotation side)
C1  33.5,7.7 90 top
C2  33.5,11.5 90 top
C3  31,7 0 top
C4  28.3,18 180 top
C5  31.4,18 180 top
C6  5.13,26.97 270 top
C7  12.87,27.03 270 top
C8  9.5,50 180 top
C9  8.6,45 0 top
C10  17.7,39.3 270 top
C11  8.7,41.5 0 top
C12  12,59.9 180 top
C13  12,55.6 180 top
C14  14.5,28.1 270 top
C15  6,31.6 90 top
C16  31.4,40.5 180 top
C17  28.2,40.5 180 top
C18  31,29.5 0 top
C19  33.5,30.2 90 top
C20  33.5,56.5 90 top
C21  31.3,63 180 top
C22  28.2,63 180 top
C23  31,52 0 top
C24  33.5,52.7 90 top
C25  33.3,33.2 90 top
C26  54.9,18 180 top
C27  51.8,18 180 top
C28  54.5,7 0 top
C29  57,7.7 90 top
C30  57,11.5 90 top
C31  54.8,40.5 180 top
C32  51.7,40.5 180 top
C33  54.5,29.5 0 top
C34  57,30.2 90 top
C35  57,34 90 top
C36  54.9,63 180 top
C37  51.8,63 180 top
C38  54.5,52 0 top
C39  57,52.7 90 top
C40  57,56.5 90 top
C41  79.5,19 180 top
C42  80.3,21.3 90 top
C43  80.5,4 90 top
C44  80.5,7 90 top
C45  80.5,10 90 top
C46  79.5,41.5 180 top
C47  80.3,43.8 90 top
C48  80.5,26.5 90 top
C49  80.5,29.5 90 top
C50  80.5,32.5 90 top
C51  79.5,64 180 top
C52  80.3,66.3 90 top
C53  80.5,49 90 top
C54  80.5,52 90 top
C55  80.5,55 90 top
F1  11.74,52.4 0 top
J2  7.5,57.63 270 top
OLED1  36,3.75 90 top
OLED2  36,26.25 90 top
OLED3  36,48.75 90 top
OLED4  59.5,3.75 90 top
OLED5  59.5,26.25 90 top
OLED6  59.5,48.75 90 top
OLED7  83,3.75 90 top
OLED8  83,26.25 90 top
OLED9  83,48.75 90 top
OSC  9.13,26.97 0 top
R1  33.5,14.6 270 top
R2  33.7,39.2 270 top
R3  12,54.2 0 top
R4  33.5,59.6 270 top
R5  57,14.6 270 top
R6  57,37.1 270 top
R7  57,59.6 270 top
R8  17.5,22.5 0 top
R9  80.5,16.1 270 top
R10  80.5,38.5 270 top
R11  80.5,61 270 top
R12  11,21 270 top
R13  12,57.03 0 top
R14  12,58.5 0 top
R15  5,21 270 top
R16  15,7 180 top
R17  9.5,21 90 top
R18  6.5,21 90 top
R19  12,61.3 0 top
R20  8.5,43.4 180 top
SJ1  10,16.5 180 top
SJ2  5.5,16.5 0 top
SW1  29,12.5 270 top
SW2  29,35 270 top
SW3  29,57.49 270 top
SW4  52.49,12.51 270 top
SW5  52.5,35 270 top
SW6  52.5,57.5 270 top
SW7  76.01,12.5 270 top
SW8  76,35 270 top
SW9  76,57.5 270 top
SW10  15,12.5 90 top
U3  9,47.5 90 top
UC1  11.81,35.41 0 top

### Tracks (layer width: path | path; a pad name or v marks a point on that pad's centre or on a via)
3.3V  (via drill 0.3, 0.7)  (1 unrouted)
  Top 0.254: v52.7,14.97 52.7,13.8 56,10.5 56.9,10.5 C30.1 58,9.6 58,8.8 58.5,8.3 OLED4.8 61.7,8.3 62,8 62,7.5 61.5,7 OLED4.6 | v29.2,16.5 29.2,13.8 32.5,10.5 33.4,10.5 C2.1 34.5,9.6 34.5,8.5 34.7,8.3 OLED1.8 38.2,8.3 38.5,8 38.5,7.5 38,7 OLED1.6 | v52.7,61.06 52.7,58.8 56,55.5 56.9,55.5 C40.1 58,54.6 58,53.5 58.2,53.3 OLED6.8 61.7,53.3 62,53 62,52.5 61.5,52 OLED6.6 | UC1.9 13.06,29.94 14,29 C14.1 14.6,29 v15.5,28.1 15.5,25.63 13.77,23.9 10.9,23.9 9.5,22.5 R17.2 R18.2 | 16,38.22 UC1.24 | UC1.36 9.06,40.24 C11.1 | C15.1 7.56,32.26 UC1.48 11.15,32.66 12,33.5 v14.5,33.5 | 7.7,41.6 C11.1 | 17.2,40.2 C10.1 17.77,40.27 | v29,61 29.1,61 29.1,58.9 32.5,55.5 33.4,55.5 C20.1 34.5,54.6 34.5,53.5 34.7,53.3 OLED3.8 38.2,53.3 38.5,53 38.5,52.5 38,52 OLED3.6 | v52.5,38 52.6,38 52.6,36.4 56,33 56.9,33 C35.1 58,32.1 58,31 58.2,30.8 OLED5.8 61.7,30.8 62,30.5 62,30 61.5,29.5 OLED5.6 | v76,38 76,31 77,30 78.9,30 79.3,30.4 79.3,31.2 79.7,31.6 C50.1 80.9,31.6 81.7,30.8 OLED8.8 85.2,30.8 85.5,30.5 85.5,30 85,29.5 OLED8.6 | v76,15 76,8.5 77,7.5 78.8,7.5 79.3,8 79.3,8.8 79.5,9 80.4,9 C45.1 80.6,9 81,9 81.7,8.3 OLED7.8 85.2,8.3 85.5,8 85.5,7.5 85,7 OLED7.6 | v76,61 76,53.5 76.9,52.6 78.7,52.6 79.2,53.1 79.2,53.5 79.8,54.1 C55.1 80.9,54.1 81.7,53.3 OLED9.8 85.2,53.3 85.5,53 85.5,52.5 85,52 OLED9.6 | v23.5,32 25.4,33.9 31.6,33.9 33.2,32.3 C25.1 34.2,32.3 34.5,32 34.5,31.2 34.9,30.8 OLED2.8 38.2,30.8 38.5,30.5 38.5,30 38,29.5 OLED2.6 | R8.2 18.35,23.55 v18.6,23.8 | C9.1 7.7,43.45 R20.2 | R20.2 7.65,41.65 C11.1 | v6.2,43.53 7.52,43.53 R20.2
  Top 0.406: 16,38.22 16,39 17.2,40.2 | v17.77,41.42 17.77,40.27 | U3.5 C9.1 | C9.1
  Bottom 0.254: v52.7,61.06 52.56,61.06 52.5,61 | v52.7,14.97 52.53,14.97 | v15.5,28.1 17.67,28.1 17.77,28 | v18.6,23.8 17.77,23.8
  Bottom 0.406: v6.2,43.53 17.77,43.53 | 17.77,43.53 v17.77,41.42 | v17.77,41.42 17.77,33.5 | 17.77,33.5 17.77,32 | 17.77,32 17.77,28 17.77,23.8 17.77,19.73 21,16.5 51.17,16.5 v52.7,14.97 52.73,15 v76,15 | 17.77,43.53 17.77,54.27 24.5,61 v29,61 52.5,61 v76,61 | v76,38 v52.5,38 26,38 22.58,41.42 v17.77,41.42 | v23.5,32 17.77,32 | v14.5,33.5 17.77,33.5
BOOT0
  Top 0.254: UC1.44 6.46,34.66 3.8,32 3.8,17.75 SJ2.1 5,16.55 R15.2
BOOT1  (via drill 0.3)
  Top 0.254: UC1.20 14.15,36.16 v13,35 | SJ1.1 10.5,16.55 10.5,18.5 11,19 R12.2 11.35,20.5 v13,20.5
  Bottom 0.254: v13,35 v13,20.5
C1N
  Top 0.254: OLED1.5 34.65,6.35 34.5,6.5 34.5,7.6 C1.2
C1N1
  Top 0.254: OLED2.5 34.85,28.85 34.5,29.2 34.5,30.1 C19.2
C1N2
  Top 0.254: OLED3.5 34.65,51.35 34.5,51.5 34.5,52.6 C24.2
C1N3
  Top 0.254: OLED4.5 58.35,6.35 58,6.7 58,7.6 C29.2
C1N4
  Top 0.254: OLED5.5 58.15,28.85 58,29 58,30.1 C34.2
C1N5
  Top 0.254: OLED6.5 58.15,51.35 58,51.5 58,52.6 C39.2
C1N6
  Top 0.254: OLED7.5 81.65,6.35 81.5,6.5 81.5,6.9 C44.2
C1N7
  Top 0.254: OLED8.5 81.65,28.85 81.5,29 81.5,29.4 C49.2
C1N8
  Top 0.254: OLED9.5 81.65,51.35 81.5,51.5 81.5,51.9 C54.2
C1P
  Top 0.254: OLED1.4 33.8,5.7 33.5,6 C1.1
C1P1
  Top 0.254: OLED2.4 34.6,28.2 C19.1
C1P2
  Top 0.254: OLED3.4 33.8,50.7 33.5,51 C24.1
C1P3
  Top 0.254: OLED4.4 57.8,5.7 57,6.5 C29.1
C1P4
  Top 0.254: OLED5.4 57.3,28.2 57,28.5 C34.1
C1P5
  Top 0.254: OLED6.4 57.3,50.7 57,51 C39.1
C1P6
  Top 0.254: OLED7.4 80.8,5.7 80.4,6.1 C44.1
C1P7
  Top 0.254: OLED8.4 80.9,28.2 C49.1
C1P8
  Top 0.254: OLED9.4 80.9,50.7 C54.1
C2N
  Top 0.254: OLED1.3 32.95,5.05 32,6 32,6.9 C3.2
C2N1
  Top 0.254: OLED2.3 32.95,27.55 31.9,28.6 C18.2
C2N2
  Top 0.254: OLED3.3 32.45,50.05 31.9,50.6 C23.2
C2N3
  Top 0.254: OLED4.3 56.45,5.05 55.5,6 55.5,6.9 C28.2
C2N4
  Top 0.254: OLED5.3 56.45,27.55 55.4,28.6 C33.2
C2N5
  Top 0.254: OLED6.3 56.45,50.05 55.4,51.1 C38.2
C2N6
  Top 0.254: OLED7.3 80.65,5.05 C43.2
C2N7
  Top 0.254: OLED8.3 80.65,27.55 C48.2
C2N8
  Top 0.254: OLED9.3 80.65,50.05 C53.2
C2P
  Top 0.254: OLED1.2 32.1,4.4 30.1,6.4 C3.1
C2P1
  Top 0.254: OLED2.2 32.1,26.9 30.1,28.9 C18.1
C2P2
  Top 0.254: OLED3.2 31.6,49.4 30.1,50.9 C23.1
C2P3
  Top 0.254: OLED4.2 55.6,4.4 54,6 54,6.6 C28.1
C2P4
  Top 0.254: OLED5.2 55.6,26.9 53.6,28.9 C33.1
C2P5
  Top 0.254: OLED6.2 55.6,49.4 53.6,51.4 C38.1
C2P6
  Top 0.254: OLED7.2 81.8,4.4 C43.1
C2P7
  Top 0.254: OLED8.2 81.9,26.9 81.5,26.5 81.4,26.5 C48.1
C2P8
  Top 0.254: OLED9.2 81.9,49.4 81.5,49 81.4,49 C53.1
CS01  (via drill 0.3)
  Top 0.254: OLED1.11 38.05,10.25 v40,8.3 | UC1.41 6.75,36.16 v3.9,33.3
  Bottom 0.254: v40,8.3 13.2,8.3 6,15.5 6,31.2 v3.9,33.3
CS02
  Top 0.254: OLED2.11 34.75,32.75 34.4,33.1 34.4,34.7 34,35.1 24.7,35.1 22.75,33.16 UC1.14
CS03  (via drill 0.3)
  Top 0.254: OLED3.11 38.25,55.25 v40.5,53 | UC1.26 14.06,40.56 21,47.5 21,51.5 v21.5,52
  Bottom 0.254: v21.5,52 39.5,52 v40.5,53
CS04  (via drill 0.3)
  Top 0.254: OLED4.11 61.95,10.25 v63,9.2 | v4,35 5.66,36.66 UC1.40
  Bottom 0.254: v63,9.2 13.8,9.2 7,16 7,32 v4,35
CS05  (via drill 0.3)
  Top 0.254: OLED5.11 61.75,32.75 v63,31.5 | UC1.16 21.36,34.16 v21.8,34.6
  Bottom 0.254: v63,31.5 26,31.5 22.9,34.6 v21.8,34.6
CS06  (via drill 0.3)
  Top 0.254: OLED6.11 61.75,55.25 v63,54 | UC1.27 13.56,41.06 20,47.5 20,52 v21,53
  Bottom 0.254: v63,54 22,54 v21,53
CS07  (via drill 0.3)
  Top 0.254: OLED7.11 85.75,10.25 v86,10 | v4,36.5 4.66,37.16 UC1.39
  Bottom 0.254: v86,10 14.5,10 8,16.5 8,32.5 v4,36.5
CS08  (via drill 0.3)
  Top 0.254: OLED8.11 85.25,32.75 v85.5,32.5 | UC1.19 19.36,35.66 v20,36.3
  Bottom 0.254: v85.5,32.5 26.6,32.5 22.8,36.3 v20,36.3
CS09  (via drill 0.3)
  Top 0.254: OLED9.11 85.25,55.25 v85.5,55 | UC1.28 13.06,41.56 19,47.5 19,52.5 v20.5,54
  Bottom 0.254: v85.5,55 21.5,55 v20.5,54
D+
  Top 0.254: J2.B6 11,56.88 R13.1 | J2.A6 8.62,57.88 9,57.5 9,56.9
D-
  Top 0.254: 11.04,58.38 J2.B7 6.49,58.38 6.3,58.2 6.3,57.6 6.51,57.38 J2.A7
  Top 0.305: 11.04,58.38 R14.1
D/C  (via drill 0.3)
  Top 0.254: OLED1.13 v38.85,11.55 | OLED7.13 v89.45,11.55 | OLED4.13 v61.95,11.55 | OLED2.13 v47.35,34.05 | OLED8.13 v85.45,34.05 v89.45,34.05 | OLED5.13 v61.95,34.05 | OLED3.13 v46.85,56.55 | OLED9.13 v85.45,56.55 v89.45,56.55 | OLED6.13 v61.95,56.55 | UC1.12 15.04,31.16 16.8,29.4 16.8,24.8 15.5,23.5 15.5,12.4 v16.35,11.55
  Bottom 0.254: v47.35,34.05 v61.95,34.05 v85.45,34.05 | v46.85,56.55 v61.95,56.55 v85.45,56.55 | v89.45,56.55 v89.45,34.05 v89.45,11.55 v61.95,11.55 v38.85,11.55 v16.35,11.55
DISP_RST  (via drill 0.3)
  Top 0.254: OLED1.12 v39.5,10.9 | OLED4.12 v62.9,10.9 | OLED7.12 v90.4,10.9 | OLED2.12 v48.5,33.4 | OLED5.12 v62.9,33.4 | OLED8.12 v86.4,33.4 v90.4,33.4 | OLED3.12 v48,55.9 | OLED6.12 v62.9,55.9 | OLED9.12 v86.4,55.9 v90.4,55.9 | UC1.11 14.06,30.44 14.5,30 15.3,30 16.2,29.1 16.2,25.2 15,24 15,11.5 v15.6,10.9
  Bottom 0.254: v48.5,33.4 v62.9,33.4 v86.4,33.4 | v48,55.9 v62.9,55.9 v86.4,55.9 | v90.4,55.9 v90.4,33.4 v90.4,10.9 v62.9,10.9 v39.5,10.9 v15.6,10.9
GND  (via drill 0.3, 1)
  Top 0.25: OLED1.27 OLED1.28
  Top 0.254: C30.2 R5.2 56.35,13.75 SW4.B 54.49,17.56 C26.2 | C2.2 R1.2 32.85,13.75 SW1.B 30.55,16.05 C5.2 | C20.2 R4.2 32.84,58.75 SW3.B 30.45,61.14 C21.2 | C31.2 53.95,38.65 SW5.B 56.35,36.25 R6.2 C35.2 | C40.2 R7.2 56.35,58.75 SW6.B 54.05,61.05 C36.2 | C41.2 78.01,18.36 SW7.B 80.15,15.6 R9.2 C45.2 78.9,10.9 78,10 SW7.B' | 78.6,64.05 C51.2 78,63.35 SW9.B 80.05,60.6 R11.2 C55.2 78.9,55.9 78,55 SW9.B' | 78.6,41.55 C46.2 78,40.85 SW8.B 80.05,38.1 R10.2 C50.2 78.9,33.4 78,32.5 SW8.B' 78,31 | OLED2.27 OLED2.28 | OLED5.27 OLED5.28 | OLED6.27 OLED6.28 | OLED6.9 OLED6.10 | OLED3.27 OLED3.28 | OLED4.27 OLED4.28 | OLED7.27 OLED7.28 | OLED8.27 OLED8.28 | OLED9.27 OLED9.28 | C16.2 30.55,38.55 SW2.B | C10.2 16.95,37.66 UC1.23 13.54,37.66 v13.5,37.7 | C11.2 9.56,41.46 UC1.35 9.56,38.54 v10.3,37.8 | UC1.47 6.66,33.16 C15.2 | J2.GND2 8.09,54.41 9,53.5 | R3.2 12.8,54.2 11.8,53.2 11.8,51.5 11.3,51 9.6,51 C8.2 | UC1.8 12.56,28.18 C7.1 | v8.8,42.3 8.8,42.2 9.5,41.5
  Top 0.406: C7.1 12.6,27.88
  other vias: 15.5,59 37.6,30.2 61.2,30.2 84.7,30.2 84.7,52.7 61.2,52.7 37.7,52.7 37.7,7.7 61.2,7.7 84.7,7.7 11.7,52.1 79.2,22.2 81.7,22.2 79.2,44.7 81.4,44.7 49.7,40.7 77.2,41.2 54.7,41.7 77.2,64.2 54.2,64.2 30.7,64.2 14.2,61.2 9.9,59.8 9.8,56.1 7.5,50.1 9,46.4 18.8,38.5 29.8,55.7 32,58.6 55.8,60 55.8,61.8 52.8,53.2 79.3,60.2 80.8,57.7 84.8,57.7 76.8,53.8 79,67.2 49.8,62.8 26.3,62.8 8.8,61.8 8.8,53.3 27.2,41.7 32.3,39.1 30.8,41.7 29.3,30.7 33.3,33.2 29.6,33.2 80.6,35.1 84.7,35.1 76.8,31.3 76.8,8.8 80.5,12.5 85,12.5 78.7,17.8 83,2.8 59.5,2.9 35.9,2.9 36,22.3 59.5,22.3 83,22.3 83,44.8 59.5,44.8 36,44.8 36,67.3 59.5,67.3 83,67.3 4.7,31 5.1,29 5,23.1 36,25.4 59.5,25.4 83,25.4 83,47.9 36,47.9 59.5,47.9 81.5,67.2 10.2,34.7 54.7,19.2 31.2,19.2 32.2,15.7 55.7,16.7 53,8.4 20.1,15.3 29,7.3 22.3,52.9 22.2,57.4 75,57.5 75,12.5 75,35 28.2,33.2 18.8,27.2 14.4,34.7 13.4,18.3 11.1,23
  pour Bottom (isolate 0.3): -1,71 93.5,71 93.5,-1 -1,-1
  pour Top (isolate 0.3): -2,72 94.5,72 94.5,-2 -2,-2
IREF
  Top 0.254: OLED1.24 34.7,18.7 33.5,17.5 R1.1
IREF1
  Top 0.254: OLED2.24 34.85,41.2 R2.1
IREF2
  Top 0.254: OLED3.24 34.7,63.7 33.5,62.5 R4.1
IREF3
  Top 0.254: R5.1 57,17.5 58.2,18.7 OLED4.24
IREF4
  Top 0.254: OLED5.24 58.2,41.2 57,40 R6.1
IREF5
  Top 0.254: R7.1 57,62.5 58.2,63.7 OLED6.24
IREF6
  Top 0.254: R9.1 80.5,17 81.5,18 81.5,18.5 81.7,18.7 OLED7.24
IREF7
  Top 0.254: OLED8.24 81.7,41.2 81.5,41 81.5,40.35 R10.1
IREF8
  Top 0.254: OLED9.24 81.7,63.7 81.5,63.5 81.5,62.85 R11.1
MOSI  (via drill 0.3)
  Top 0.254: OLED5.17 v61.85,36.65 | v87.35,36.65 OLED8.17 | v87.35,59.15 OLED9.17 | v87.35,14.15 OLED7.17 | v61.85,14.15 OLED4.17 | v38.35,36.65 OLED2.17 34.65,36.65 34.5,36.5 22.5,36.5 20.66,34.66 UC1.17 | v38.35,59.15 OLED3.17 | OLED6.17 v61.85,59.15
  Top 0.305: OLED1.17 37.65,14.15 v38.65,15.15
  Bottom 0.254: v61.85,14.15 v87.35,14.15 v87.35,36.65 | v38.35,36.65 v61.85,36.65 v87.35,36.65 | v38.35,59.15 v61.85,59.15 v87.35,59.15 v87.35,36.65
  Bottom 0.305: v38.65,15.15 50.95,15.15 51.95,14.15 v61.85,14.15
N$1
  Top 0.254: SW10.B' SW10.B 13,8.15 R16.2
N$2
  Top 0.254: SJ2.2 5.95,18.45 6.5,19 R18.1
N$3
  Top 0.254: R17.1 9.5,16.55 SJ1.2
N$4
  Top 0.254: OLED1.26 30.5,20 29.2,18.7 C4.1
N$5
  Top 0.254: OLED2.26 30,42.5 29.1,41.6 C17.1
N$6  (1 unrouted)
  Top 0.254: OLED3.26 30,65 29.1,64.1 29.1,62.5
N$7
  Top 0.254: OLED6.26 54,65 52.7,63.7 C37.1
N$8
  Top 0.254: OLED5.26 54,42.5 52.6,41.1 C32.1
N$9
  Top 0.254: J2.A5 8.59,58.88 9,59.3 9,60.5 9.8,61.3 R19.1
N$10
  Top 0.254: OLED4.26 54.1,20 52.7,18.6 C27.1
N$11
  Top 0.254: J2.B5 8.91,55.88 10.4,54.4 10.95,54.4 R3.1
N$12
  Top 0.254: OLED8.26 80.7,42.5 C47.1
N$13
  Top 0.254: OLED7.26 80.7,20 C42.1 80.2,20.5
N$14
  Top 0.254: OLED9.26 80.7,65 C52.1
OSC_IN
  Top 0.254: C6.2 5.43,25.82 OSC.1 7.3,25.8 7.9,25.8 9,26.9 9,29 9.7,29.7 10.5,29.7 11.06,30.26 UC1.5
OSC_OUT
  Top 0.254: C7.2 12.82,26.18 12,27 11.5,27 11,27.5 11,28.11 OSC.3 11.56,28.7 UC1.6
RESET
  Top 0.254: UC1.7 12.06,32.06 12.5,32.5 14.55,32.5 17.5,29.55 17.5,24.65 16.65,23.8 R8.1 16.65,15.95 SW10.A' SW10.A
SCK  (via drill 0.3)
  Top 0.254: v88.5,58.5 v85.5,58.5 OLED9.16 | v88.5,36 v85.5,36 OLED8.16 | v63,36 OLED5.16 | OLED7.16 v88.5,13.5 | OLED4.16 v63,13.5 | OLED6.16 v63,58.5 | v39.5,36 OLED2.16 34.9,36 34.7,35.8 24.3,35.8 22.16,33.66 UC1.15 | OLED3.16 v40,58.5
  Top 0.305: OLED1.16 38.5,13.5 v39.5,14.5
  Bottom 0.254: v63,13.5 v88.5,13.5 v88.5,36 v88.5,58.5 | v39.5,36 v63,36 v85.5,36 | v40,58.5 v63,58.5 v85.5,58.5
  Bottom 0.305: v63,13.5 51.6,13.5 50.6,14.5 v39.5,14.5
SW01
  Top 0.254: SW1.A 23.4,15.6 20,19 20,30.5 17.84,32.66 UC1.13
  Top 0.305: SW1.A SW1.A'
SW02
  Top 0.254: SW2.A 23.1,38.1 20.16,35.16 UC1.18
SW03
  Top 0.254: SW3.A' 25.89,54.39 22,50.5 22,47.5 14.56,40.06 UC1.25
  Top 0.305: SW3.A' SW3.A
SW04  (via drill 0.3)
  Top 0.254: v4,38 4.34,37.66 UC1.38
  Top 0.305: SW4.A v50.49,12.5 | v50.49,12.5 SW4.A' | v50.5,12.5 v50.49,12.5
  Bottom 0.254: v50.5,12.5 13.5,12.5 9,17 9,33 v4,38
SW05  (via drill 0.3)
  Top 0.254: 50.5,35 v45,35 | UC1.22 18.66,37.16 20,38.5 v22,38.5
  Top 0.305: SW5.A 50.5,35 SW5.A'
  Bottom 0.254: v45,35 27,35 23.5,38.5 v22,38.5
SW06  (via drill 0.3, 1)
  Top 0.254: 50.5,57.5 v39,57.5 | UC1.30 12.06,42.66 17,47.6 17,55.5 v20.5,59 v25,59
  Top 0.305: SW6.A' 50.5,57.5 SW6.A
  Bottom 0.254: v39,57.5 26.5,57.5 v25,59
SW07  (via drill 0.3)
  Top 0.254: v4.5,39 5.34,38.16 UC1.37 | SW7.A v74.01,12.51 v74,12.5 v74.01,12.49 SW7.A'
  Bottom 0.254: v74,12.5 51.6,12.5 50.6,13.5 14,13.5 10,17.5 10,33.5 v4.5,39
SW08  (via drill 0.3)
  Top 0.254: UC1.21 19.16,36.66 20,37.5 v21,37.5
  Top 0.305: SW8.A v74,35 SW8.A'
  Bottom 0.254: v74,35 46.5,35 44.7,33.2 34.6,33.2 33.8,34 26.5,34 23,37.5 v21,37.5
SW09  (via drill 0.3)
  Top 0.254: UC1.29 12.56,42.06 18,47.5 18,53 v20,55
  Top 0.305: SW9.A v74,57.5 SW9.A'
  Bottom 0.254: v74,57.5 40.5,57.5 39.5,56.5 21.5,56.5 v20,55
UART1_RX  (via drill 1)
  Top 0.254: UC1.31 11.56,43.06 16,47.5 16,57 v18,59
USBDM
  Top 0.254: C12.1 R14.2 13.7,58.5 15,57.2 15,48 11.06,44.06 UC1.32
USBDP
  Top 0.254: C13.1 R13.2 13.96,57.03 14.2,56.8 14.2,48.3 10.56,44.66 10.56,43.4 | UC1.33 10.56,43.4 | R20.1 10.56,43.4
V_USB
  Top 0.254: 10.95,46.55 11,46.5 | 13,52.25 F1.2 | 11.45,48.45 11.5,48.5 | U3.3 10.3,49.9 C8.1
  Top 0.406: U3.1 10.95,46.55 | U3.3 11.45,48.45 | 11,46.5 11.5,47 11.5,48.5 11.5,50.3 13,51.8 13,52.25
VCOMH
  Top 0.254: OLED1.25 33.6,19.35 C5.1
VCOMH1
  Top 0.254: OLED2.25 33.6,41.85 C16.1
VCOMH2
  Top 0.254: OLED3.25 33.5,64.35 C21.1
VCOMH3
  Top 0.254: OLED4.25 57.1,19.35 C26.1
VCOMH4
  Top 0.254: OLED5.25 57,41.85 C31.1
VCOMH5
  Top 0.254: OLED6.25 57.1,64.35 C36.1
VCOMH6
  Top 0.254: OLED7.25 80.7,19.35 C41.1
VCOMH7
  Top 0.254: OLED8.25 80.7,41.85 C46.1
VCOMH8
  Top 0.254: OLED9.25 80.7,64.35 C51.1
VUSB-RAW
  Top 0.305: 7.42,60 J2.VBUS1
  Top 0.406: 7.42,60 6.7,60 5.6,58.9 5.6,56.3 6.71,55.19 J2.VBUS2 8.31,55.19 10.1,53.4 10.1,52.64 F1.1

### Text on the board
tNames: GND | PA10/RX | PA09/TX | BOOT0 | BOOT1 | RESET
bNames: GND | PA10/RX | PA09/TX | Keybon REV 1.1 / Maximilian Kern 12/2020 / github.com/CoretechR
Measures: 3 | 6 | 9 | 2 | 5 | 8 | 1 | 4 | 7